# EAGLE design v2164_quad_VC_mixer_0402_DIL (EAGLE 7.7.0)
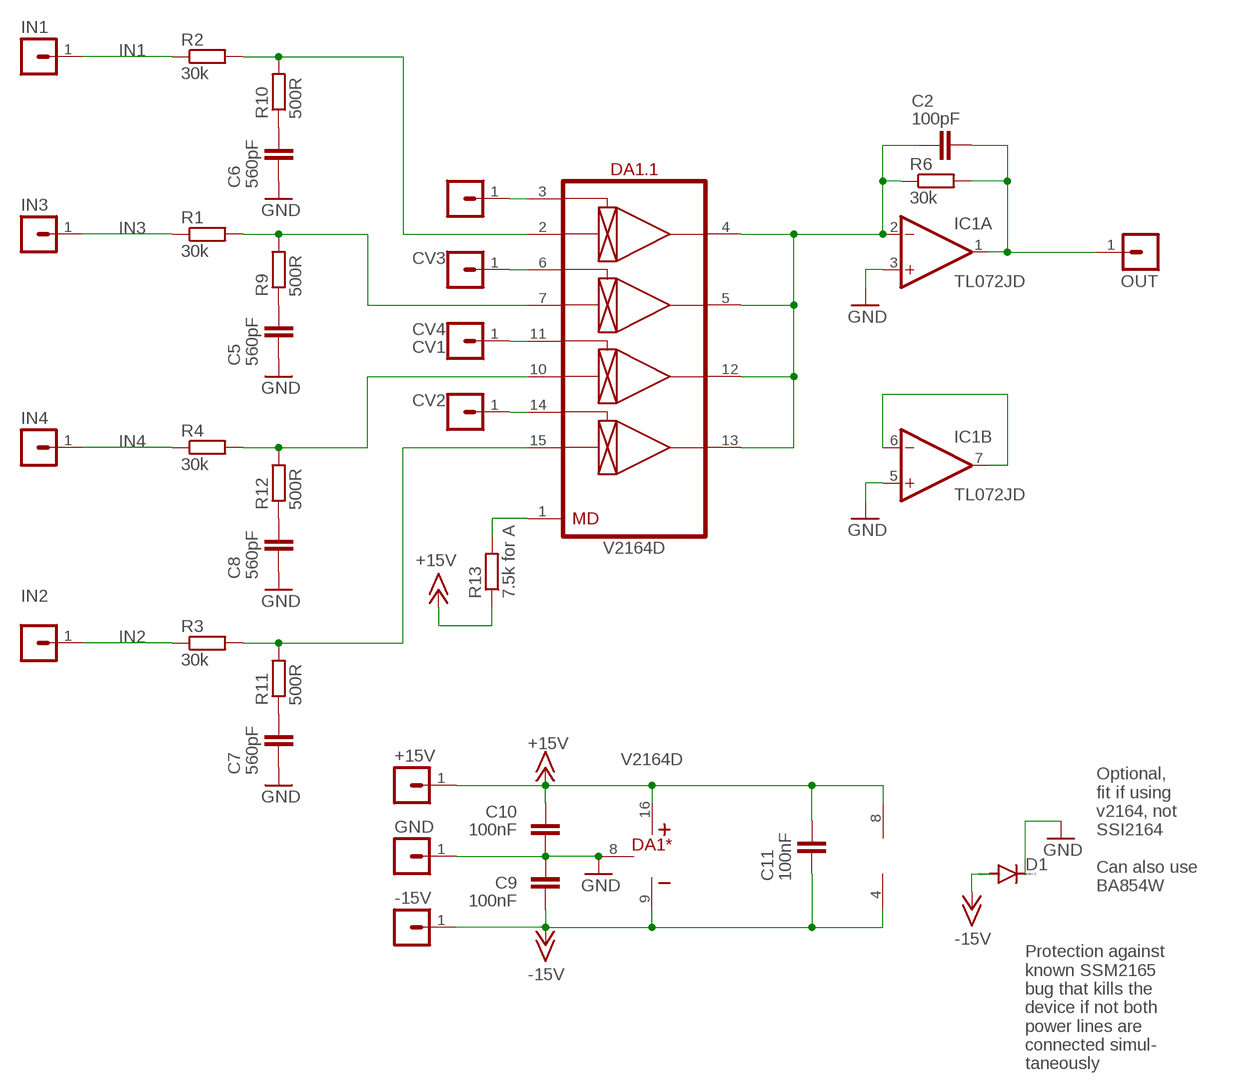
[diagram p0: schematic, sheet 1]

## Parts
+15V  MA01-1JP  [SIP-PIN01-1J]
-15V  MA01-1JP  [SIP-PIN01-1J]
C2  100pF  C-EUC0402  [C0402]
C5  560pF  C-EUC0603  [C0603]
C6  560pF  C-EUC0603  [C0603]
C7  560pF  C-EUC0603  [C0603]
C8  560pF  C-EUC0603  [C0603]
C9  100nF  C-EUC0402  [C0402]
C10  100nF  C-EUC0402  [C0402]
C11  100nF  C-EUC0402  [C0402]
CV1  MA01-1JP  [SIP-PIN01-1J]
CV2  MA01-1JP  [SIP-PIN01-1J]
CV3  MA01-1JP  [SIP-PIN01-1J]
CV4  MA01-1JP  [SIP-PIN01-1J]
D1  DIODE-SOD323-R  [SOD323-R]
DA1  V2164D  [DIP-16]
GND  MA01-1JP  [SIP-PIN01-1J]
IC1  TL072JD  [SO08J]
IN1  MA01-1JP  [SIP-PIN01-1J]
IN2  MA01-1JP  [SIP-PIN01-1J]
IN3  MA01-1JP  [SIP-PIN01-1J]
IN4  MA01-1JP  [SIP-PIN01-1J]
OUT  MA01-1JP  [SIP-PIN01-1J]
R1  30k  R-EU_R0402  [R0402]
R2  30k  R-EU_R0402  [R0402]
R3  30k  R-EU_R0402  [R0402]
R4  30k  R-EU_R0402  [R0402]
R6  30k  R-EU_R0402  [R0402]
R9  500R  R-EU_R0402  [R0402]
R10  500R  R-EU_R0402  [R0402]
R11  500R  R-EU_R0402  [R0402]
R12  500R  R-EU_R0402  [R0402]
R13  7.5k for A  R-EU_R0402  [R0402]

## Nets
+15V: +15V.1 C10.2 C11.2 DA1.16(*:V+) IC1.8(P:V+) R13.1
-15V: -15V.1 C9.1 C11.1 D1.A DA1.9(*:V-) IC1.4(P:V-)
GND: C5.1 C6.1 C7.1 C8.1 C9.2 C10.1 D1.C DA1.8(*:GND) GND.1 IC1.3(A:+IN) IC1.5(B:+IN)
IN1: IN1.1 R2.1
IN2: IN2.1 R3.1
IN3: IN3.1 R1.1
IN4: IN4.1 R4.1
N$2: DA1.1(.1:MD) R13.2
N$4: CV1.1 DA1.3(.1:CV1)
N$6: CV3.1 DA1.6(.1:CV2)
N$8: CV2.1 DA1.14(.1:CV4)
N$9: C5.2 R9.1
N$10: C6.2 R10.1
N$11: C7.2 R11.1
N$12: C8.2 R12.1
N$13: CV4.1 DA1.11(.1:CV3)
N$14: C2.1 DA1.4(.1:OUT1) DA1.5(.1:OUT2) DA1.12(.1:OUT3) DA1.13(.1:OUT4) IC1.2(A:-IN) R6.1
N$17: DA1.7(.1:IN2) R1.2 R9.2
N$18: DA1.2(.1:IN1) R2.2 R10.2
N$19: DA1.15(.1:IN4) R3.2 R11.2
N$20: DA1.10(.1:IN3) R4.2 R12.2
OUT3: C2.2 IC1.1(A:OUT) OUT.1 R6.2
OUT4: IC1.6(B:-IN) IC1.7(B:OUT)

## Notes on the sheet
- Optional,
  fit if using
  v2164, not
  SSI2164
  
  Can also use
  BA854W
- Protection against
  known SSM2165
  bug that kills the
  device if not both
  power lines are 
  connected simul-
  taneously

## Library data of the parts
+15V -15V CV1-CV4 GND IN1-IN4 OUT = joakim:MA01-1J: PIN HEADER
C2 C5-C11 = rcl:C-EU: CAPACITOR, European symbol; SPICEPREFIX: C
D1 = diode:DIODE-: DIODE
DA1 = ic-coolaudio:V2164
IC1 = joakim:TL072J: OP AMP
R1-R4 R6 R9-R13 = rcl:R-EU_: RESISTOR, European symbol; SPICEPREFIX: R

## Board
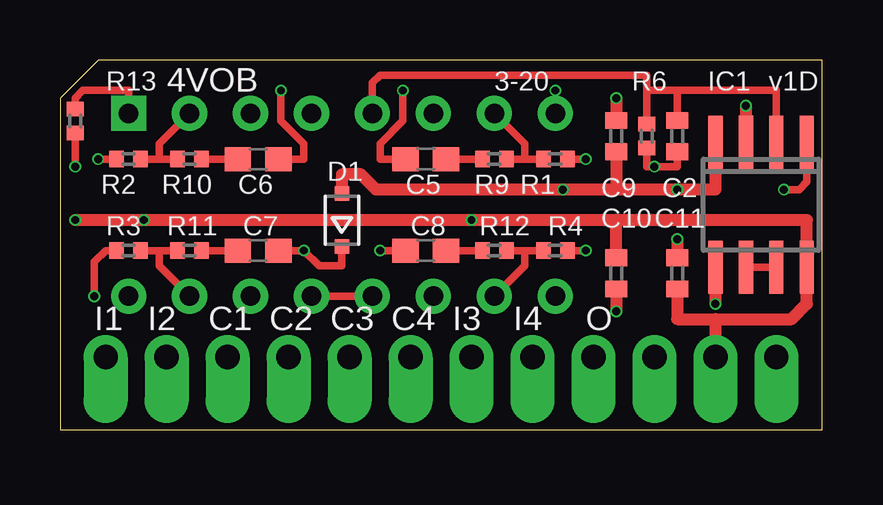
[diagram p1: board, top side]
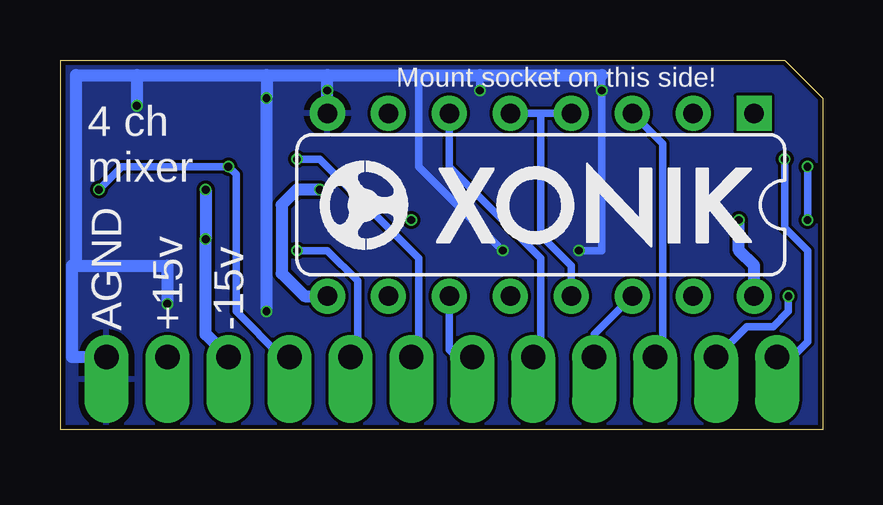
[diagram p2: board, bottom side, seen from below]

Size 31.75 x 15.4 mm. Coordinates in mm from the lower left corner, seen from the top.
Outline: 0,0 31.75,0 31.75,15.4 1.59,15.4 0,13.81 0,0
Copper layers (1*16): Top 0.035mm / dielectric 1.6mm / Bottom 0.035mm
Design rules "jlcpcb-2layers": minimum track width 5mil, minimum drill 0.3mm, track to track 5mil, track to pad 5mil, pad to pad 5mil, via to via 5mil, smd to smd 5mil, copper to edge 0.2mm, drill to drill 6mil, minimum pad ring 10mil, minimum via ring 3mil, stop-mask expansion 4mil, vias tented up to drill 0mil, thermal gap 10mil

### Footprints (pad centres in the part's own frame; a part is rotated, then mirrored left to right if it is on the bottom)
SIP-PIN01-1J = drill 1.016 offset: 1 0,0
C0402 = smd 0.7 x 0.9: 1 -0.65,0; 2 0.65,0
C0603 = smd 1.1 x 1: 1 -0.85,0; 2 0.85,0
SOD323-R = smd 0.6 x 0.6: A 1.1,0; C -1.1,0
DIP-16 = drill 0.813 square: 1 -8.89,-3.81 | drill 0.813: 2 -6.35,-3.81; 3 -3.81,-3.81; 4 -1.27,-3.81; 5 1.27,-3.81; 6 3.81,-3.81; 7 6.35,-3.81; 8 8.89,-3.81; 9 8.89,3.81; 10 6.35,3.81; 11 3.81,3.81; 12 1.27,3.81; 13 -1.27,3.81; 14 -3.81,3.81; 15 -6.35,3.81; 16 -8.89,3.81
SO08J = smd 0.6 x 2.2: 1 -1.905,-2.6; 2 -0.635,-2.6; 3 0.635,-2.6; 4 1.905,-2.6; 5 1.905,2.6; 6 0.635,2.6; 7 -0.635,2.6; 8 -1.905,2.6
R0402 = smd 0.6 x 0.7: 1 -0.5,0; 2 0.5,0

### Placement (x,y rotation side)
+15V  27.3,3.02 0 top
-15V  24.77,3.02 0 top
C2  25.72,12.22 270 top
C5  15.24,11.27 0 top
C6  8.25,11.27 180 top
C7  8.25,7.46 180 top
C8  15.24,7.46 0 top
C9  23.18,12.22 90 top
C10  23.18,6.51 90 top
C11  25.72,6.51 270 top
CV1  6.99,3.02 0 top
CV2  9.52,3.02 0 top
CV3  12.06,3.02 0 top
CV4  14.6,3.02 0 top
D1  11.75,8.73 90 top
DA1  11.75,9.37 180 bottom
GND  29.85,3.02 0 top
IC1  29.21,9.37 180 top
IN1  1.91,3.02 0 top
IN2  4.45,3.02 0 top
IN3  17.14,3.02 0 top
IN4  19.69,3.02 0 top
OUT  22.23,3.02 0 top
R1  20.64,11.27 180 top
R2  2.86,11.27 0 top
R3  2.86,7.46 0 top
R4  20.64,7.46 180 top
R6  24.45,12.22 270 top
R9  18.1,11.27 0 top
R10  5.4,11.27 180 top
R11  5.4,7.46 180 top
R12  18.1,7.46 0 top
R13  0.64,12.86 90 top
U$1  [XONIK_LOGO_18]  20.96,7.52 0 bottom

### Tracks (layer width: path | path; a pad name or v marks a point on that pad's centre or on a via)
+15V  (via drill 0.33)
  Top 0.305: R13.1 v0.64,10.95
  Top 0.508: 23.18,8.73 31.12,8.73 IC1.8 31.12,5.24 30.48,4.6 27.32,4.6 | 23.18,8.73 v17.14,8.73 v3.49,8.73 v0.64,8.73 | C10.2 23.18,8.73 | 27.32,4.6 27.32,3.03 +15V.1 | C11.2 25.72,4.6 27.32,4.6
  Bottom 0.305: v0.64,10.95 v0.64,8.73
  Bottom 0.508: DA1.16 2.86,6.83 3.49,7.46 v3.49,8.73
-15V  (via drill 0.33)
  Top 0.508: IC1.4 27.3,10 v25.72,10 23.18,10 | 23.18,10 v20.96,10 13.18,10 12.54,10.64 11.75,10.64 D1.A | C9.1 23.18,10 | v25.72,7.94 C11.1
  Bottom 0.508: v20.96,10 21.91,10 22.54,9.37 22.54,6.51 21.59,5.56 DA1.9 | -15V.1 25.72,3.97 v25.72,7.94 v25.72,10
GND  (via drill 0.33)
  Top 0.305: C6.1 10.16,11.27 10.16,11.91 9.21,12.86 v9.21,14.13 | C7.1 v10.16,7.46 10.8,6.83 11.75,6.83 D1.C | C5.1 13.33,11.27 13.33,11.91 14.29,12.86 v14.29,14.13 | C8.1 v13.33,7.46
  Top 0.508: v23.18,13.81 C9.2 | C10.1 v23.18,4.92 | v28.57,13.49 IC1.3 | IC1.5 v27.3,5.24
  Bottom 0.305: 9.21,14.76 v9.21,14.13 9.21,7.46 v10.16,7.46 | v14.29,14.13 14.29,14.76 | v13.33,7.46 16.83,10.95 16.83,14.76
  Bottom 0.508: 28.57,14.76 31.12,14.76 31.12,6.83 | 28.57,14.76 23.18,14.76 | 23.18,14.76 20.64,14.76 | 20.64,14.76 16.83,14.76 14.29,14.76 9.21,14.76 | 20.64,14.76 v20.64,14.13 DA1.8 | 23.18,14.76 v23.18,13.81 v23.18,4.92 | 28.57,14.76 v28.57,13.49 | 31.12,6.83 31.27,6.83 31.27,3.02 GND.1 | 31.12,6.83 27.3,6.83 v27.3,5.24
  pour Bottom: 0,0 0,15.4 31.75,15.4 31.75,0
IN1  (via drill 0.33)
  Top 0.305: v1.59,11.27 R2.1
  Bottom 0.305: IN1.1 1.27,3.02 0.64,3.65 0.64,7.46 1.59,8.41 v1.59,11.27
IN2  (via drill 0.33)
  Top 0.305: R3.1 1.91,7.46 1.43,6.99 v1.43,5.56
  Bottom 0.305: v1.43,5.56 1.43,4.92 2.06,4.29 3.18,4.29 IN2.1
IN3  (via drill 0.33)
  Top 0.305: v21.91,11.27 R1.1
  Bottom 0.305: IN3.1 16.83,3.33 16.83,7.14 20.96,11.27 v21.91,11.27
IN4  (via drill 0.33)
  Top 0.305: R4.1 v21.91,7.46
  Bottom 0.305: v21.91,7.46 20.64,7.46 19.37,6.19 19.37,3.33 IN4.1
N$2
  Top 0.305: DA1.1 2.86,14.13 0.95,14.13 0.64,13.81 R13.2
N$4
  Bottom 0.305: DA1.3 6.67,11.91 6.67,3.33 CV1.1
N$6
  Bottom 0.305: DA1.6 15.56,10.95 11.75,7.14 11.75,3.33 CV3.1
N$8
  Bottom 0.305: CV2.1 9.52,3.97 DA1.14
N$9
  Top 0.305: R9.1 C5.2
N$10
  Top 0.305: R10.1 C6.2
N$11
  Top 0.305: C7.2 R11.1
N$12
  Top 0.305: R12.1 C8.2
N$13
  Bottom 0.305: DA1.11 15.56,3.33 15.24,3.02 CV4.1
N$14
  Top 0.305: 25.72,14.13 24.45,14.13 | 24.45,14.13 R6.1 | C2.1 25.72,14.13 | IC1.2 29.85,14.13 25.72,14.13 | 24.45,14.13 24.45,14.76 13.33,14.76 13.02,14.45 DA1.5 | DA1.13 DA1.12
  Bottom 0.305: DA1.13 10.48,6.83 11.75,8.1 11.75,13.18 | 11.75,13.18 DA1.4 | DA1.5 11.75,13.18
N$17
  Top 0.305: R1.2 19.37,11.27 | 19.37,11.27 R9.2 | 19.37,11.27 19.37,11.91 DA1.7
N$18
  Top 0.305: R2.2 4.13,11.27 | 4.13,11.27 R10.2 | 4.13,11.27 4.13,11.91 DA1.2
N$19
  Top 0.305: R11.2 4.13,7.46 | 4.13,7.46 R3.2 | DA1.15 4.13,6.83 4.13,7.46
N$20
  Top 0.305: R4.2 19.37,7.46 | 19.37,7.46 R12.2 | DA1.10 19.37,6.83 19.37,7.46
OUT3  (via drill 0.33)
  Top 0.305: R6.2 24.45,10.95 v24.76,10.95 25.72,10.95 C2.2 | IC1.1 31.12,10.32 30.8,10 v30.16,10
  Bottom 0.305: v30.16,10 29.21,10.95 v24.76,10.95 24.45,10.64 24.45,4.92 22.54,3.02 OUT.1
OUT4
  Top 0.305: IC1.7 IC1.6

### Text on the board
tNames: 4VOB | 3-20 | v1D | I1 | I2 | C1 | C2 | C3 | C4 | I3 | I4 | O
bNames: Mount socket on this side! | 4 ch / mixer | -15v | +15v | AGND